# EAGLE design Tactile.Sensing.Module.Orientation.4 (EAGLE 7.7.0)
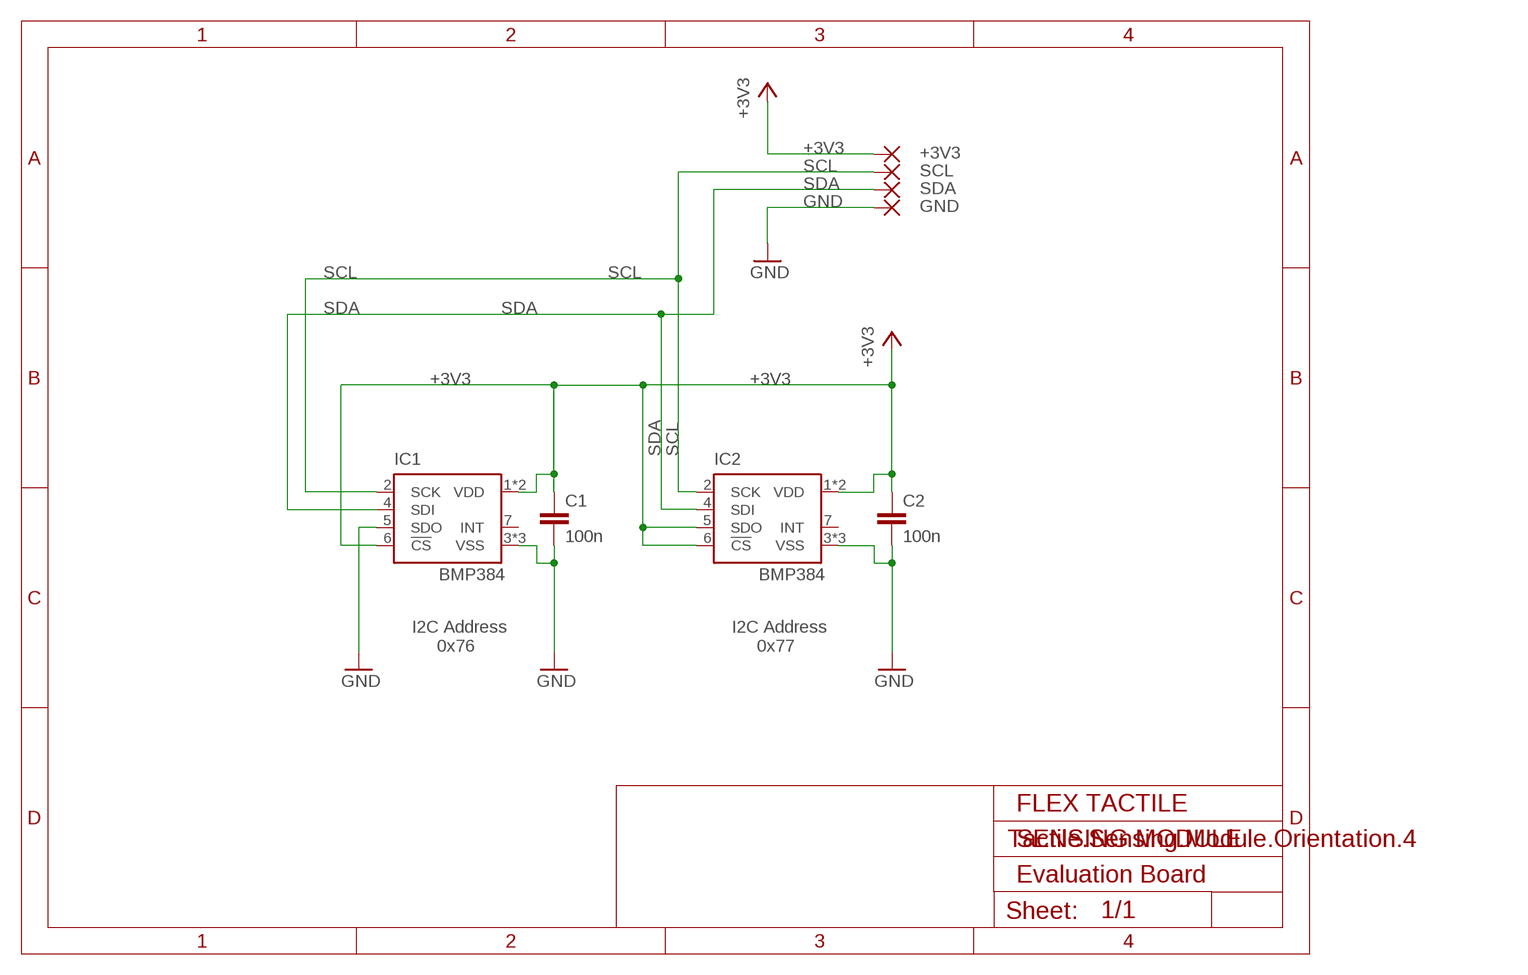
[diagram p0: schematic, sheet 1]

## Parts
+3V3  SMD-PAD-2MMX4MM  [SMD-PAD-2MMX4MM]
C1  100n  C-EUC0201  [C0201]
C2  100n  C-EUC0201  [C0201]
GND  SMD-PAD-2MMX4MM  [SMD-PAD-2MMX4MM]
IC1  BMP384  [BMP384]
IC2  BMP384  [BMP384]
SCL  SMD-PAD-2MMX4MM  [SMD-PAD-2MMX4MM]
SDA  SMD-PAD-2MMX4MM  [SMD-PAD-2MMX4MM]

## Nets
+3V3: +3V3.1(P) C1.1 C2.1 IC1.1(VDD) IC1.6(!CS) IC1.10(VDD) IC2.1(VDD) IC2.5(SDO) IC2.6(!CS) IC2.10(VDD)
GND: C1.2 C2.2 GND.1(P) IC1.3(VSS) IC1.5(SDO) IC1.8(VSS) IC1.9(VSS) IC2.3(VSS) IC2.8(VSS) IC2.9(VSS)
SCL: IC1.2(SCK) IC2.2(SCK) SCL.1(P)
SDA: IC1.4(SDI) IC2.4(SDI) SDA.1(P)
Unconnected: IC1.7(INT) IC2.7(INT)

## Notes on the sheet
- I2C Address 
       0x76
- I2C Address 
       0x77
- FLEX TACTILE
- SENSING MODULE
- Evaluation Board

## Library data of the parts
+3V3 GND SCL SDA = wirepad_lib_vignesh:SMD-PAD-2MMX4MM: SMD PAD
C1 C2 = rcl:C-EU: CAPACITOR, European symbol
IC1 IC2 = BMP384:BMP384

## Board
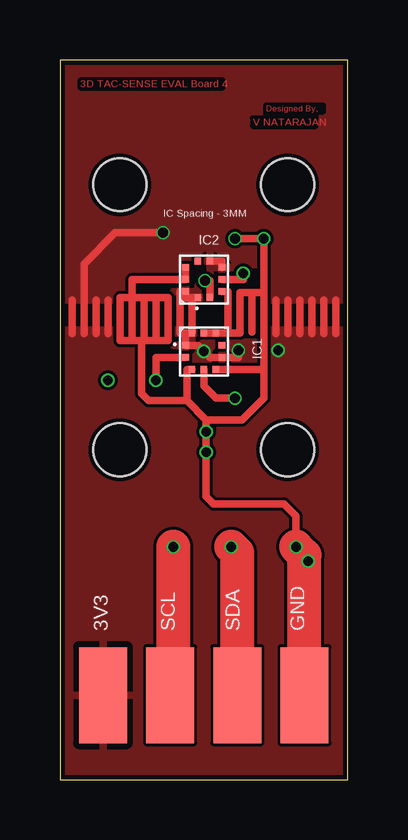
[diagram p1: board, top side]
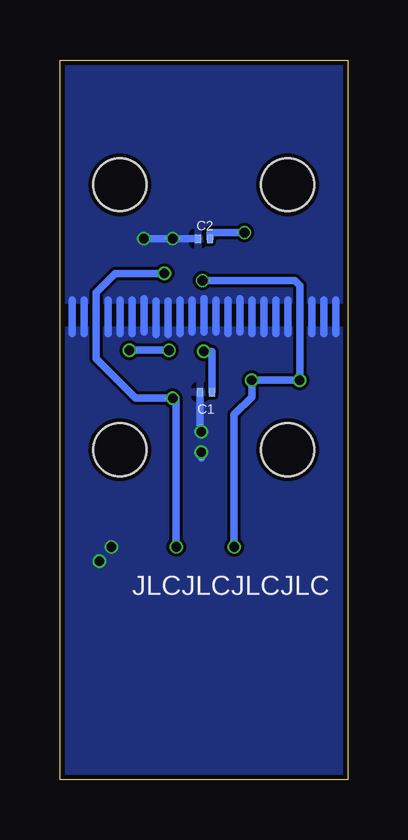
[diagram p2: board, bottom side, seen from below]

Size 12 x 30 mm. Coordinates in mm from the lower left corner, seen from the top.
Outline: 0,0 12,0 12,30 0,30 0,0
Copper layers (1*16): Top 0.035mm / dielectric 1.6mm / Bottom 0.035mm
Design rules "jlcpcb-2layers *": minimum track width 5mil, minimum drill 0.3mm, track to track 5mil, track to pad 5mil, pad to pad 5mil, via to via 5mil, smd to smd 5mil, copper to edge 0.2mm, drill to drill 6mil, minimum pad ring 10mil, minimum via ring 3mil, stop-mask expansion 0.001mm, vias tented up to drill 0.001mm, thermal gap 10mil
Holes 2.2 mm at 2.5,24.8 9.5,24.8 2.5,13.75 9.5,13.75

### Footprints (pad centres in the part's own frame; a part is rotated, then mirrored left to right if it is on the bottom)
SMD-PAD-2MMX4MM = smd 2 x 4: 1 0,0
C0201 = smd 0.25 x 0.35: 1 -0.25,0; 2 0.25,0
BMP384 = smd 0.28 x 0.29: 1 0.25,0.757; 2 -0.25,0.757; 6 -0.25,-0.757; 7 0.25,-0.757 | smd 0.29 x 0.28: 3 -0.757,0.5; 4 -0.757,0; 5 -0.757,-0.5; 8 0.757,-0.5; 9 0.757,0; 10 0.757,0.5

### Placement (x,y rotation side)
+3V3  1.8,3.52 0 top
C1  5.9,16.15 180 bottom
C2  6,22.55 180 bottom
GND  10.2,3.52 0 top
IC1  6,17.85 90 top
IC2  6,20.85 180 top
SCL  4.6,3.52 0 top
SDA  7.4,3.52 0 top

### Tracks (layer width: path | path; a pad name or v marks a point on that pad's centre or on a via)
+3V3  (via drill 0.4)
  Top 0.305: 0.5,20 0.5,18.6 | 9,20 9,18.6 | 10,20 10,18.6 | 10.5,20 10.5,18.6 | 11,20 11,18.6 | 11.5,20 11.5,18.6 | 9.5,20 9.5,18.6 | 1,18.6 1,21.5 2.3,22.8 v4.3,22.8 | 1.5,20 1.5,18.6 | 2,20 2,18.6 | IC1.10 5,18.61 5,20.09 | 5,20.09 5,20.35 IC2.10 | IC1.10 5.24,18.61 IC1.1 5.75,18.1 v6,17.85 6.25,17.6 7.45,17.6 v7.45,17.9 | IC2.1 5,20.09 | IC1.10 5.5,20 | IC2.5 6.76,21.61 IC2.6 | v9.1,17.9 9.15,17.9
  Bottom 0.305: C1.1 5.65,17.85 v6,17.85 | v7.45,17.9 v9.1,17.9 | v4.3,22.8 5.75,22.8 C2.1
  pour Top: 0,18.75 12,18.75 12,0 0,0
  pour Top: 0,30 12,30 12,20 0,20
GND  (via drill 0.4)
  Top 0.305: 6.1,15 7.6,15 8.5,15.9 8.5,17.2 | 6.1,15 v6.1,14.5 v6.1,13.65 6.1,12.1 6.1,11.8 6.4,11.5 9.35,11.5 9.85,11 v9.85,9.7 | IC1.9 IC1.8 | IC1.3 5.3,17.09 5.3,15.8 | 8.5,17.2 8.5,20.3 | 8.5,20.3 v8.5,22.55 v7.3,22.55 | 3,20.04 3,18.3 | 3,20.04 3.2,20.09 | 3.2,20.09 3.5,20.09 | 3.2,20.09 2.5,20.09 2.5,18.3 3.5,18.3 | 3.5,20.09 3.5,18.3 | 3.5,18.3 4,18.3 | 4,18.3 4,20.1 | 3.5,20.09 4.5,20.09 4.5,18.3 4,18.3 | IC2.8 IC2.9 3,20.85 3,20.04 | 6.75,18.61 IC1.8 | 7,18.61 7.5,18.61 7.5,20.3 8,20.3 | 7,18.61 IC1.8 | 7,18.61 7,20.35 IC2.3 | 8,20.3 8.5,20.3 | 8,18.65 8,20.3 | IC1.5 8.39,17.09 arc90 8.5,17.2 | 5.3,15.8 3.7,15.8 3.4,16.1 3.4,18.2 arc-90 3.5,18.3 | 6.1,15 5.3,15.8
  Top 1.422: GND.1 10.2,9.35 v9.85,9.7
  Bottom 0.305: v6.1,14.5 6.15,14.5 C1.2 | v6.1,13.65 6.1,13.4 | v8.5,22.55 v7.3,22.55 C2.2 | 11.5,20 11.5,18.6 | 0.5,20 0.5,18.6 | 1,20 1,18.6 | 1.5,20 1.5,18.6 | 2.5,20 2.5,18.6 | 3,20 3,18.6 | 3.5,20 3.5,18.6 | 4,20 4,18.6 | 5,20 5,18.6 | 7,20 7,18.6 | 9,20 9,18.6 | 9.5,20 9.5,18.6 | 11,20 11,18.6 | 5.5,20 5.5,18.65 | 6,20.05 6,18.65 | 6.5,20 6.5,18.65 | 8.5,20.05 8.5,18.65 | 8,19.95 8,18.55 | 7.5,19.95 7.5,18.55 | 4.5,20.05 4.5,18.65 | 10,20 10,18.6
  other vias: 10.35,9.1
  pour Bottom: 0,0 12,0 12,18.75 0,18.75
  pour Bottom: 0,20 12,20 12,30 0,30
SCL  (via drill 0.4)
  Top 0.305: v4,16.65 4,17.6 IC1.2 | IC2.2 6.25,20.8 v6.05,20.8
  Top 1.422: SCL.1 4.73,3.52 v4.73,9.7
  Bottom 0.305: v4.73,9.7 4.73,15.22 4,15.95 v4,16.65 v2,16.65 2,20.6 2.2,20.8 v6.05,20.8
SDA  (via drill 0.4)
  Top 0.305: v7.3,15.9 6.5,15.9 6,16.4 IC1.4 | IC2.4 7.65,20.85 v7.65,21.1
  Top 1.422: SDA.1 7.4,9.45 v7.15,9.7
  Bottom 0.305: v7.15,9.7 7.15,15.9 v7.3,15.9 8.85,15.9 10.5,17.55 10.5,20.3 9.7,21.1 v7.65,21.1 | v7.65,21.1 7.5,21.1 | 8,21.1 v7.65,21.1

### Text on the board
Top: 3D TAC-SENSE EVAL Board 4 | Designed By, | V NATARAJAN
bPlace: JLCJLCJLCJLC
tNames: IC Spacing - 3MM | 3V3 | SCL | SDA | GND
tStop: 3D TAC-SENSE EVAL Board 4 | Designed By, | V NATARAJAN
tRestrict: 3D TAC-SENSE EVAL Board 4 | Designed By, | V NATARAJAN
Document: Bend Zone